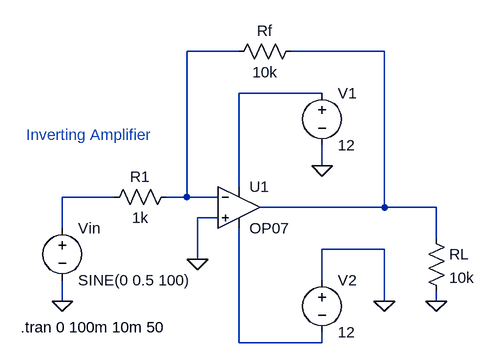
[diagram p0: schematic Inverting.asc]
Inverting.asc, the LTspice schematic file:
Version 4
SHEET 1 880 680
WIRE 160 0 80 0
WIRE 384 0 240 0
WIRE 288 64 160 64
WIRE 288 176 288 144
WIRE 160 208 160 64
WIRE -32 224 -112 224
WIRE 80 224 80 0
WIRE 80 224 48 224
WIRE 128 224 80 224
WIRE 384 240 384 0
WIRE 384 240 192 240
WIRE 464 240 384 240
WIRE 128 256 96 256
WIRE -112 272 -112 224
WIRE 464 288 464 240
WIRE 384 304 288 304
WIRE 96 320 96 256
WIRE 288 352 288 304
WIRE -112 384 -112 352
WIRE 384 384 384 304
WIRE 464 384 464 368
WIRE 160 448 160 272
WIRE 288 448 288 432
WIRE 288 448 160 448
FLAG 288 176 0
FLAG -112 384 0
FLAG 96 320 0
FLAG 384 384 0
FLAG 464 384 0
SYMBOL OpAmps\\OP07 160 176 R0
SYMATTR InstName U1
SYMBOL voltage 288 48 R0
SYMATTR InstName V1
SYMATTR Value 12
SYMBOL voltage 288 336 R0
SYMATTR InstName V2
SYMATTR Value 12
SYMBOL voltage -112 256 R0
SYMATTR InstName Vin
SYMATTR Value SINE(0 0.5 100)
SYMBOL res 448 272 R0
SYMATTR InstName RL
SYMATTR Value 10k
SYMBOL res 64 208 R90
WINDOW 0 0 56 VBottom 2
WINDOW 3 32 56 VTop 2
SYMATTR InstName R1
SYMATTR Value 1k
SYMBOL res 256 -16 R90
WINDOW 0 0 56 VBottom 2
WINDOW 3 32 56 VTop 2
SYMATTR InstName Rf
SYMATTR Value 10k
TEXT -176 424 Left 2 !.tran 0 100m 10m 50
TEXT -168 128 Left 2 ;Inverting Amplifier

The netlist it stands for:
* Inverting.asc
XU1 0 N001 N003 N005 N002 LT1001  ; OP07, pins In+ In- V+ V- OUT
V1 N003 0 12
V2 0 N005 12
Vin N004 0 SINE(0 0.5 100)
RL N002 0 10k
R1 N001 N004 1k
Rf N002 N001 10k
.tran 0 100m 10m 50
* Inverting Amplifier
.lib LTC.lib
.backanno
.end